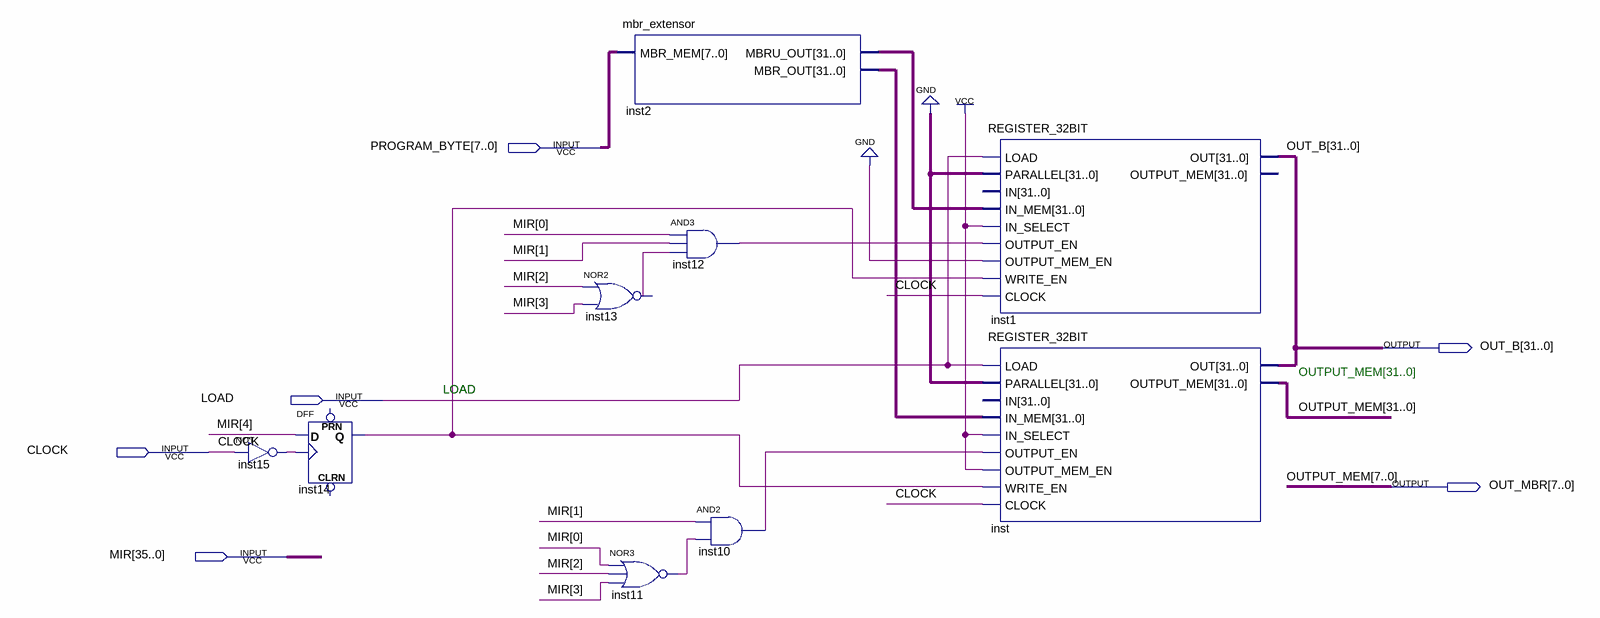
[diagram p0: schematic sheet]
// Quartus schematic MBR.bdf as structural Verilog: 9 symbols, 6 pins
module MBR (
  input  [7:0] PROGRAM_BYTE,
  input  LOAD,
  input  CLOCK,
  input  [35:0] MIR,
  output [31:0] OUT_B,
  output [7:0] OUT_MBR
);

  wire inst10_out, inst11_out, inst12_out, inst13_out, inst14_q, inst15_out;
  wire [31:0] inst2_mbr_out, inst2_mbru_out;
  wire [31:8] OUTPUT_MEM;

  not inst15 (inst15_out, CLOCK);
  DFF inst14 (.CLK(inst15_out), .D(MIR[4]), .Q(inst14_q));  // open: CLRN, PRN
  mbr_extensor inst2 (.MBR_MEM(PROGRAM_BYTE), .MBRU_OUT(inst2_mbru_out), .MBR_OUT(inst2_mbr_out));
  nor inst13 (inst13_out, MIR[2], MIR[3]);
  nor inst11 (inst11_out, MIR[0], MIR[2], MIR[3]);
  and inst12 (inst12_out, MIR[0], MIR[1], inst13_out);
  and inst10 (inst10_out, MIR[1], inst11_out);
  REGISTER_32BIT inst1 (
    .LOAD(LOAD), .PARALLEL({32{1'b0}}), .IN_MEM(inst2_mbru_out), .IN_SELECT(1'b1), .OUTPUT_EN(inst12_out),
    .OUTPUT_MEM_EN(1'b0), .WRITE_EN(inst14_q), .CLOCK(CLOCK), .OUT(OUT_B));  // open: IN, OUTPUT_MEM
  REGISTER_32BIT inst (
    .LOAD(LOAD), .PARALLEL({32{1'b0}}), .IN_MEM(inst2_mbr_out), .IN_SELECT(1'b1), .OUTPUT_EN(inst10_out),
    .OUTPUT_MEM_EN(1'b1), .WRITE_EN(inst14_q), .CLOCK(CLOCK), .OUT(OUT_B), .OUTPUT_MEM({OUTPUT_MEM, OUT_MBR}));  // open: IN

  // Other names for the same wires on the sheet: OUTPUT_MEM[7:0] = OUT_MBR

  // Notes on the sheet:
  //   OUTPUT_MEM[31..0]
  //   LOAD
endmodule
